# Altium schematic sheet MPU6050.SchDoc
size A4
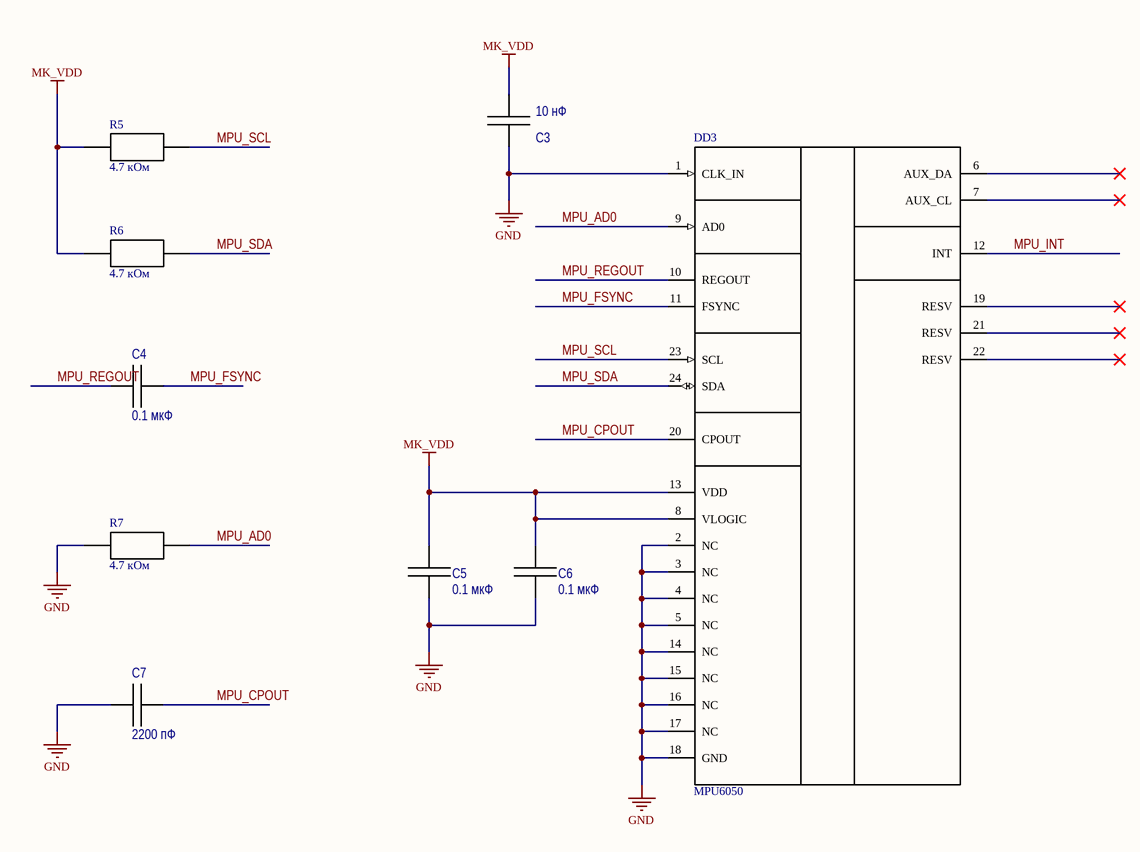
[diagram p0: MPU6050.SchDoc]

## Parts
C3  10 нФ  [C 1206]
C4  0.1 мкФ  [C 1206]
C5  0.1 мкФ  [C 1206]
C6  0.1 мкФ  [C 1206]
C7  2200 пФ  [C 1206]
DD3  MPU6050  [QFN50P400X400X95_HS-25N]
R5  4.7 кОм  [RES 0805]
R6  4.7 кОм  [RES 0805]
R7  4.7 кОм  [RES 0805]

## Nets
GND: C3.1 C5.2 C6.2 C7.1 DD3.1(CLK_IN) DD3.2(NC) DD3.3(NC) DD3.4(NC) DD3.5(NC) DD3.14(NC) DD3.15(NC) DD3.16(NC) DD3.17(NC) DD3.18(GND) R7.2
MK_VDD: C3.2 C5.1 C6.1 DD3.8(VLOGIC) DD3.13(VDD) R5.2 R6.2
MPU_AD0: DD3.9(AD0) R7.1
MPU_CPOUT: C7.2 DD3.20(CPOUT)
MPU_FSYNC: C4.2 DD3.11(FSYNC)
MPU_INT: DD3.12(INT)
MPU_REGOUT: C4.1 DD3.10(REGOUT)
MPU_SCL: DD3.23(SCL) R5.1
MPU_SDA: DD3.24(SDA) R6.1

Not connected (* = marked no-connect by the designer): DD3 6(AUX_DA)* 7(AUX_CL)* 19(RESV)* 21(RESV)* 22(RESV)*

## Library data of the parts
C3-C7 = CAP 1206: SMD Capacitor 1206; Manufacturer: /Укажите компанию-производителя/; Tolerance: /Укажите допуск в процентах/; Temperature coefficient: /Формат: ±? ppm/°C/; Type: Конденсатор керамический; TC: /Укажите тип диэлектрика/; Size: 1206; Temperature range: /Формат: -? ... ? °C/
R5-R7 = RES 0805